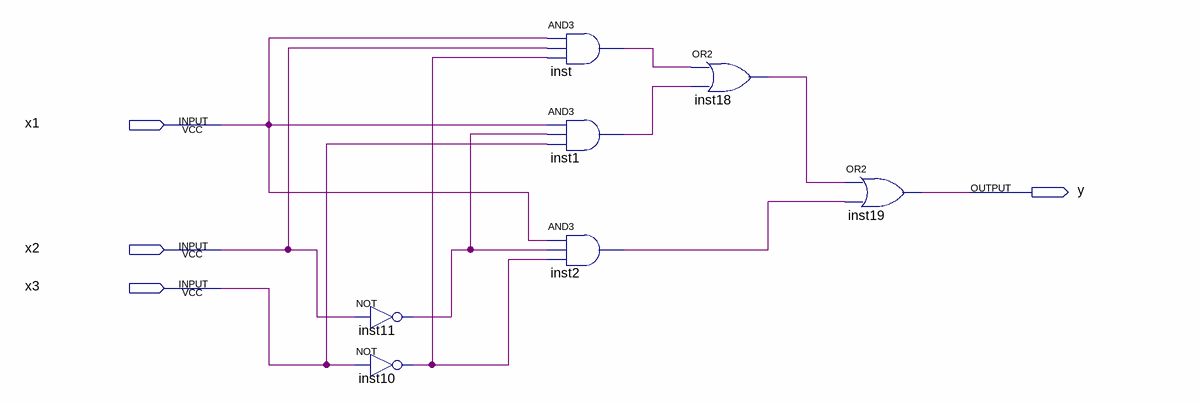
[diagram p0: schematic sheet]
// Quartus schematic LC1.bdf as structural Verilog: 7 symbols, 4 pins
module LC1 (
  input  x1,
  input  x2,
  input  x3,
  output y
);

  wire inst1_out, inst2_out, inst10_out, inst11_out, inst18_out, inst_out;

  not inst11 (inst11_out, x2);
  not inst10 (inst10_out, x3);
  and inst (inst_out, x1, x2, inst10_out);
  and inst1 (inst1_out, x1, inst11_out, x3);
  and inst2 (inst2_out, x1, inst11_out, inst10_out);
  or inst18 (inst18_out, inst_out, inst1_out);
  or inst19 (y, inst18_out, inst2_out);
endmodule
